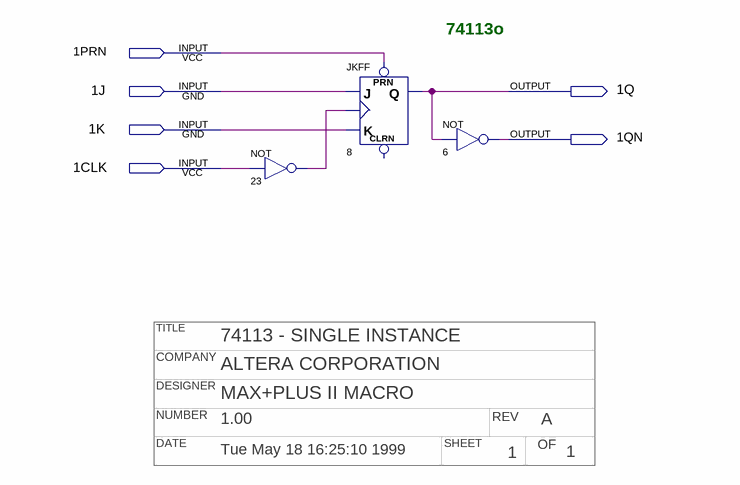
[diagram p0: schematic sheet]
// Quartus schematic 74113o.bdf as structural Verilog: 3 symbols, 6 pins
// Title block: TITLE: 74113 - SINGLE INSTANCE; COMPANY: ALTERA CORPORATION; DESIGNER: MAX+PLUS II MACRO; NUMBER: 1.00; REV: A; DATE: Tue May 18 16:25:10 1999; SHEET: 1; OF: 1
module \74113o  (
  input  \1PRN ,
  input  \1J ,
  input  \1K ,
  input  \1CLK ,
  output \1Q ,
  output \1QN 
);

  wire n23_out;

  not u_23 (n23_out, \1CLK );
  JKFF u_8 (.PRN(\1PRN ), .K(\1K ), .J(\1J ), .CLK(n23_out), .Q(\1Q ));  // open: CLRN
  not u_6 (\1QN , \1Q );

  // Notes on the sheet:
  //   74113o
endmodule
